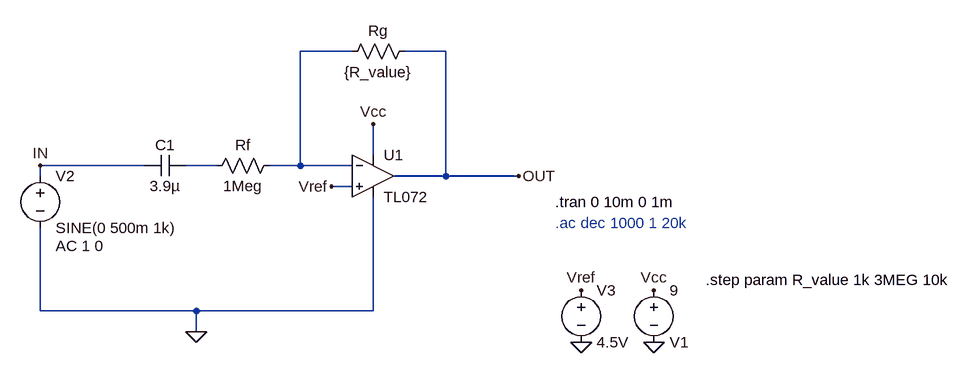
[diagram p0: schematic Headphone amp draft 1.asc]
Headphone amp draft 1.asc, the LTspice schematic file:
Version 4
SHEET 1 1212 680
WIRE 192 -16 112 -16
WIRE 336 -16 272 -16
WIRE 224 144 224 96
WIRE -128 160 -288 160
WIRE -16 160 -64 160
WIRE 112 160 112 -16
WIRE 112 160 64 160
WIRE 192 160 112 160
WIRE -288 176 -288 160
WIRE 336 176 336 -16
WIRE 336 176 256 176
WIRE 448 176 336 176
WIRE 192 192 160 192
WIRE -288 384 -288 256
WIRE -48 384 -288 384
WIRE 224 384 224 208
WIRE 224 384 -48 384
WIRE -48 416 -48 384
FLAG 656 432 0
FLAG -48 416 0
FLAG 448 176 OUT
FLAG -288 160 IN
FLAG 160 192 Vref
FLAG 544 352 Vref
FLAG 544 432 0
FLAG 656 352 Vcc
FLAG 224 96 Vcc
SYMBOL OpAmps\\TL072 224 112 R0
SYMATTR InstName U1
SYMBOL voltage 656 336 R0
WINDOW 0 24 96 Left 2
WINDOW 3 24 16 Left 2
WINDOW 123 0 0 Left 0
WINDOW 39 0 0 Left 0
SYMATTR InstName V1
SYMATTR Value 9
SYMBOL res 80 144 R90
WINDOW 0 0 56 VBottom 2
WINDOW 3 32 56 VTop 2
SYMATTR InstName Rf
SYMATTR Value 1Meg
SYMBOL cap -64 144 R90
WINDOW 0 0 32 VBottom 2
WINDOW 3 32 32 VTop 2
SYMATTR InstName C1
SYMATTR Value 3.9µ
SYMBOL voltage -288 160 R0
WINDOW 123 24 124 Left 2
WINDOW 39 0 0 Left 0
SYMATTR InstName V2
SYMATTR Value SINE(0 500m 1k)
SYMATTR Value2 AC 1 0
SYMBOL res 288 -32 R90
WINDOW 0 0 56 VBottom 2
WINDOW 3 32 56 VTop 2
SYMATTR InstName Rg
SYMATTR Value {R_value}
SYMBOL voltage 544 336 R0
WINDOW 123 0 0 Left 0
WINDOW 39 0 0 Left 0
SYMATTR InstName V3
SYMATTR Value 4.5V
TEXT 504 216 Left 2 !.tran 0 10m 0 1m
TEXT 736 336 Left 2 !.step param R_value 1k 3MEG 10k
TEXT 504 248 Left 2 ;.ac dec 1000 1 20k

The netlist it stands for:
* Headphone amp draft 1.asc
XU1 Vref N001 Vcc 0 OUT TL072  ; pins In+ In- V+ V- OUT
V1 Vcc 0 9
Rf N001 N002 1Meg
C1 N002 IN 3.9µ
V2 IN 0 SINE(0 500m 1k) AC 1 0
Rg OUT N001 {R_value}
V3 Vref 0 4.5V
.tran 0 10m 0 1m
.step param R_value 1k 3MEG 10k
* .ac dec 1000 1 20k
.backanno
.end